# EAGLE design VoltageSourcePCBLT6000 (EAGLE 9.4.2)
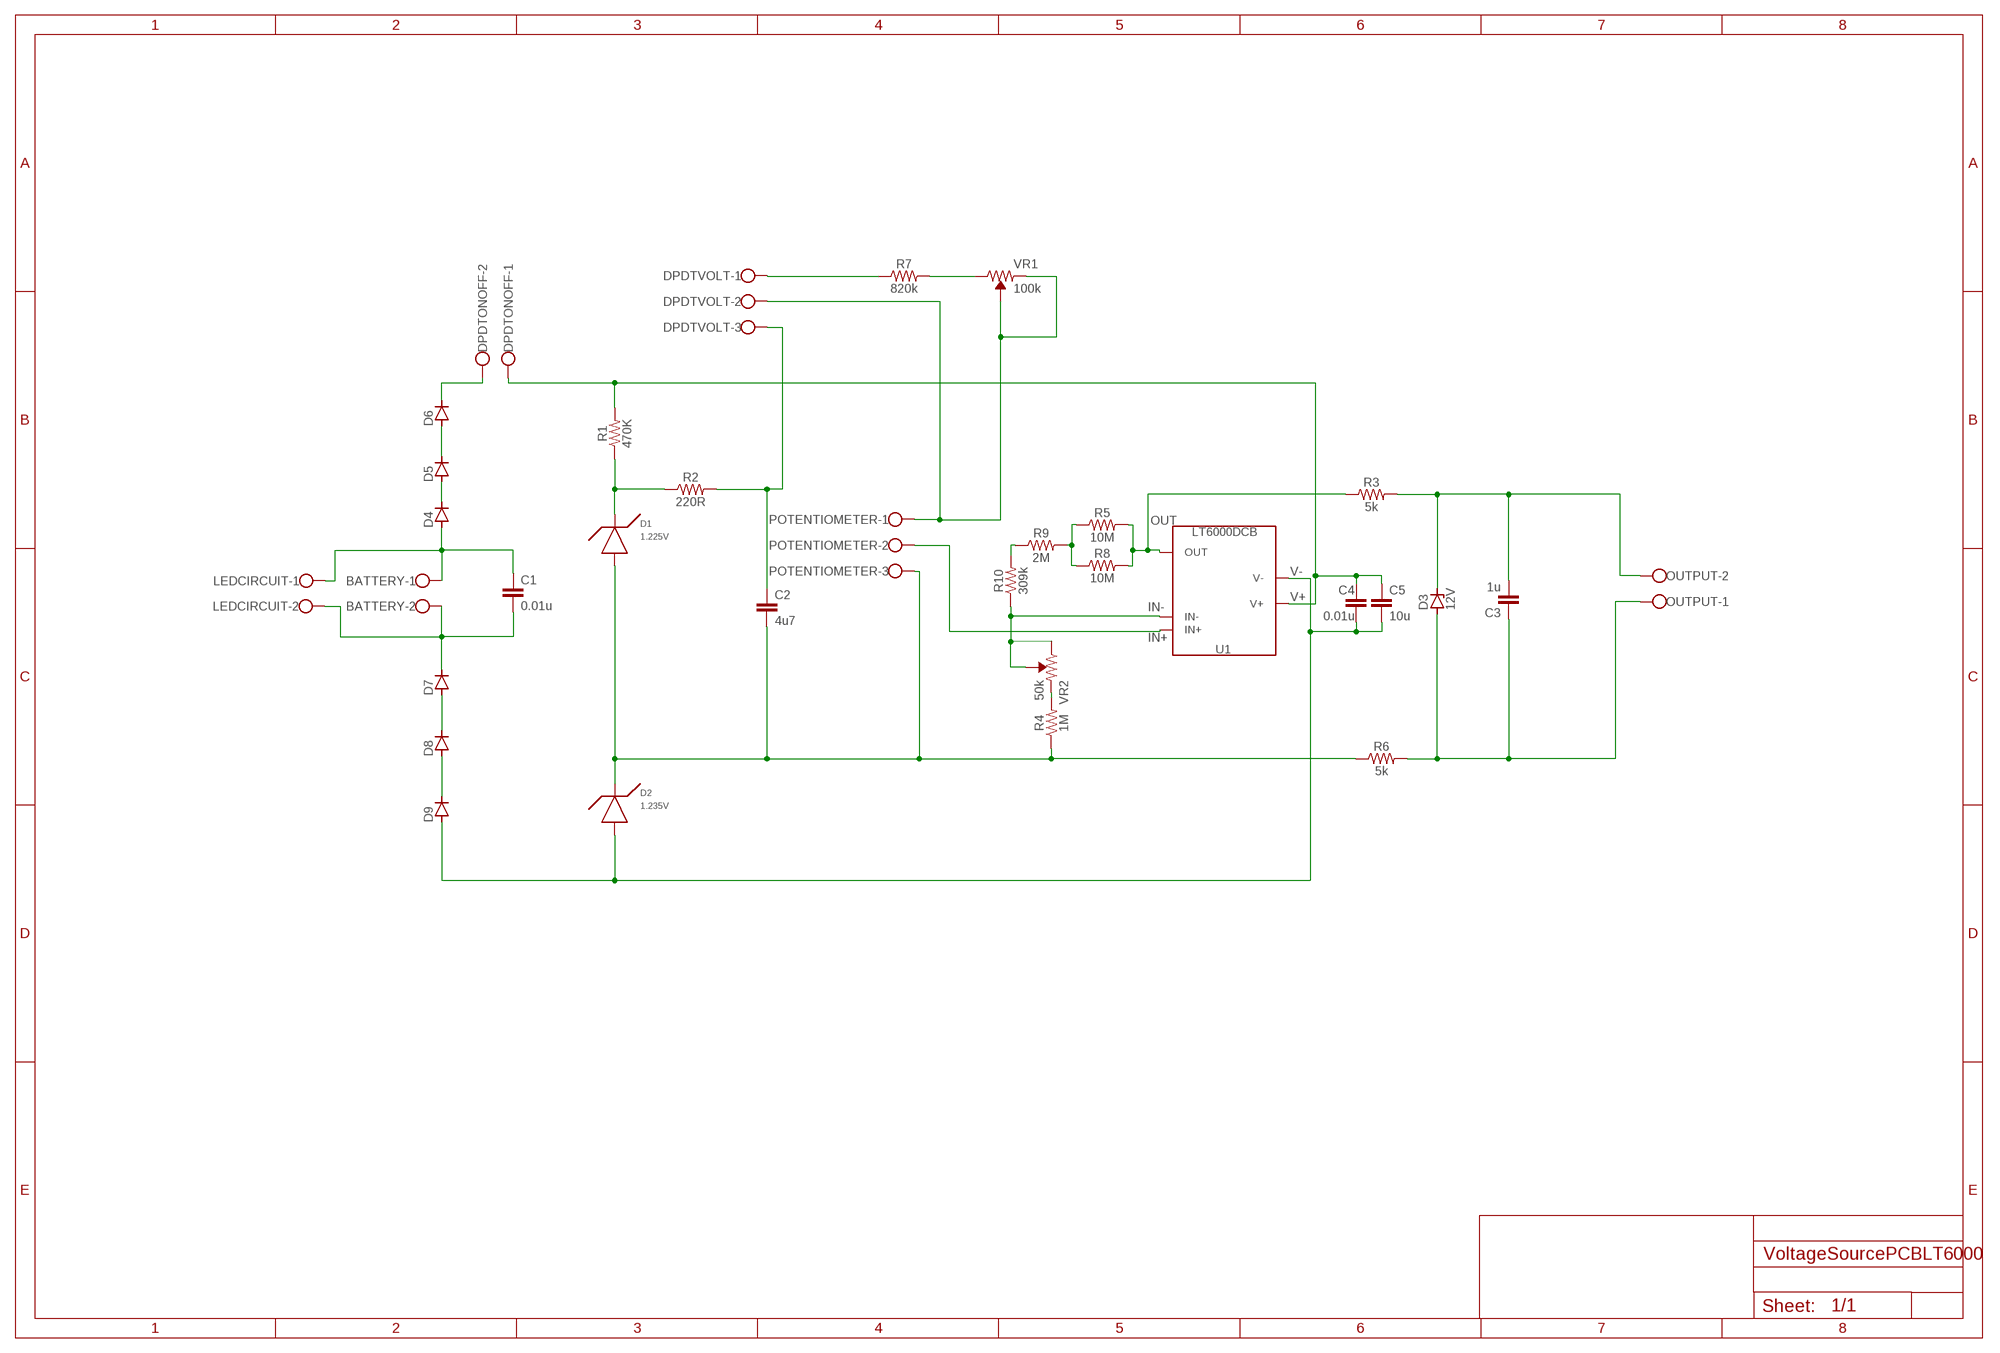
[diagram p0: schematic, sheet 1]

## Parts
BATTERY  W237-102  [W237-102]
C1  0.01u  C5/2.5  [C5B2.5]
C2  4u7  C22/11  [C22.5B11]
C3  1u  C-EU150-072X183  [C150-072X183]
C4  0.01u  C5/2.5  [C5B2.5]
C5  10u  C5/2.5  [C5B2.5]
D1  1.225V  LT1004CZ1.225V  [LT1004CZ]
D2  1.235V  LT1004CZ1.235V  [LT1004CZ]
D3  12V  ZENER-DIODEC1702-15  [C1702-15]
D4  D-SOD123  [SOD123]
D5  D-SOD123  [SOD123]
D6  D-SOD123  [SOD123]
D7  D-SOD123  [SOD123]
D8  D-SOD123  [SOD123]
D9  D-SOD123  [SOD123]
DPDTONOFF  W237-102  [W237-102]
DPDTVOLT  W237-103  [W237-103]
LEDCIRCUIT  W237-102  [W237-102]
OUTPUT  W237-102  [W237-102]
POTENTIOMETER  W237-103  [W237-103]
R1  470K  RESISTOR0805  [0805]
R2  220R  RESISTOR0805  [0805]
R3  5k  RESISTOR0805  [0805]
R4  1M  RESISTOR0805  [0805]
R5  10M  RESISTOR0805  [0805]
R6  5k  RESISTOR0805  [0805]
R7  820k  RESISTOR0805  [0805]
R8  10M  RESISTOR0805  [0805]
R9  2M  RESISTOR0805  [0805]
R10  309k  RESISTOR0805  [0805]
U1  LT6000DCB  [LT6000]
VR1  100k  TRIMPOT-SMD-3MM-OPEN-1/10W-25%  [TRIMPOT-SMD-TC33X]
VR2  50k  TRIMPOT-SMD-3MM-OPEN-1/10W-25%  [TRIMPOT-SMD-TC33X]

## Nets
IN+: POTENTIOMETER.2 U1.3(IN+)
IN-: R10.1 U1.2(IN-) VR2.1(CW) VR2.2(WIPER)
N$1: BATTERY.2 C1.2 D7.1(C) LEDCIRCUIT.2
N$2: D6.1(C) DPDTONOFF.2
N$4: D4.1(C) D5.2(A)
N$5: D5.1(C) D6.2(A)
N$6: D1.CATHODE R1.1 R2.1
N$7: C2.2 D1.ANODE D2.CATHODE POTENTIOMETER.3 R4.1 R6.1
N$8: C2.1 DPDTVOLT.3 R2.2
N$9: D7.2(A) D8.1(C)
N$10: D8.2(A) D9.1(C)
N$11: DPDTVOLT.2 POTENTIOMETER.1 VR1.2(WIPER) VR1.3(CCW)
N$12: DPDTVOLT.1 R7.1
N$14: BATTERY.1 C1.1 D4.2(A) LEDCIRCUIT.1
N$15: R5.1 R8.1 R9.2
N$16: C3.2 D3.C OUTPUT.2 R3.2
N$17: C3.1 D3.A OUTPUT.1 R6.2
N$18: R4.2 VR2.3(CCW)
N$19: R7.2 VR1.1(CW)
N$20: R9.1 R10.2
OUT: R3.1 R5.2 R8.2 U1.4(OUT)
V+: C4.1 C5.1 DPDTONOFF.1 R1.2 U1.6(V+)
V-: C4.2 C5.2 D2.ANODE D9.2(A) U1.5(V-) U1.7(V-)

## Library data of the parts
BATTERY DPDTONOFF LEDCIRCUIT OUTPUT = con-wago-500:W237-102: WAGO SCREW CLAMP; MPN: 237-102; OC_FARNELL: unknown; OC_NEWARK: 70K9898
C1 C2 C4 C5 = capacitor-wima:C: CAPACITOR naming: grid - package width
C3 = rcl:C-EU: CAPACITOR, European symbol; SPICEPREFIX: C
D1 D2 = RequiredComponents:LT1004CZ: The LT1004CZ zener diode is one that is contained in a 3 pin holder. This can be used as a micropower voltage reference, as it will supply a constant voltage.
D3 = diode:ZENER-DIODE: Z-Diode
D4-D9 = semicon-smd-ipc:D-: DIODE unfilled
DPDTVOLT POTENTIOMETER = con-wago-500:W237-103: WAGO SCREW CLAMP; MPN: 237-103; OC_FARNELL: unknown; OC_NEWARK: 18M7116
R1-R10 = SparkFun-Resistors:RESISTOR: Generic Resistor Package
U1 = RequiredComponents:LT6000: The LT6000 is a low noise, low current (16uA) op-amp, which takes a supply voltage of 16V.
VR1 VR2 = SparkFun-Resistors:TRIMPOT: Trimming Potentiometer (Trimpot) Three-terminal potentiometers, with an adjustable wiper and two adjustable resistors. A pot can be used to create a configurable voltage divider, or as a variable resistor. "Trimpots" are a subset of potentiometers, usually intended for "set-and-forget" applications. They're often more delicate than standard potentiometers - rated for fewer turns. Variants PTH-KNOB - PTH Trimpot w/ finger-adjustable knob Trimpot 10K with Knob <https://www.sparkfun.com/products/9806> (COM-09806) Datasheet <http://www.sparkfun.com/datasheets/Components/General/TSR-3386.pdf> SMD-3MM-CLOSED-FRAME - SMD 3mm Square Closed-Frame Trimpot Used on e.g. EasyDriver - Stepper Motor Driver <https://www.sparkfun.com/products/12779> Datasheet <http://www.bitechnologies.com/pdfs/22.pdf> (22AR10KTR) SMD-5MM - SMD 5mm Square Closed-Frame Trimpot Used on e.g. IOIO-OTG - V2.2 <https://www.sparkfun.com/products/13613> Datasheet <http://www.vishay.com/docs/51008/ts53.pdf> (TS53YL502MR10) SMD-3MM-1/10W-25% - 3mm Square Open-Frame Trimpot Used on e.g. SparkFun Shapeoko <https://www.sparkfun.com/products/13899> Datasheet <http://www.bourns.com/docs/Product-Datasheets/TC33.pdf> (TC33X-2-103E); PROD_ID: RES-12428, RES-08048; VALUE: 10k

## Board
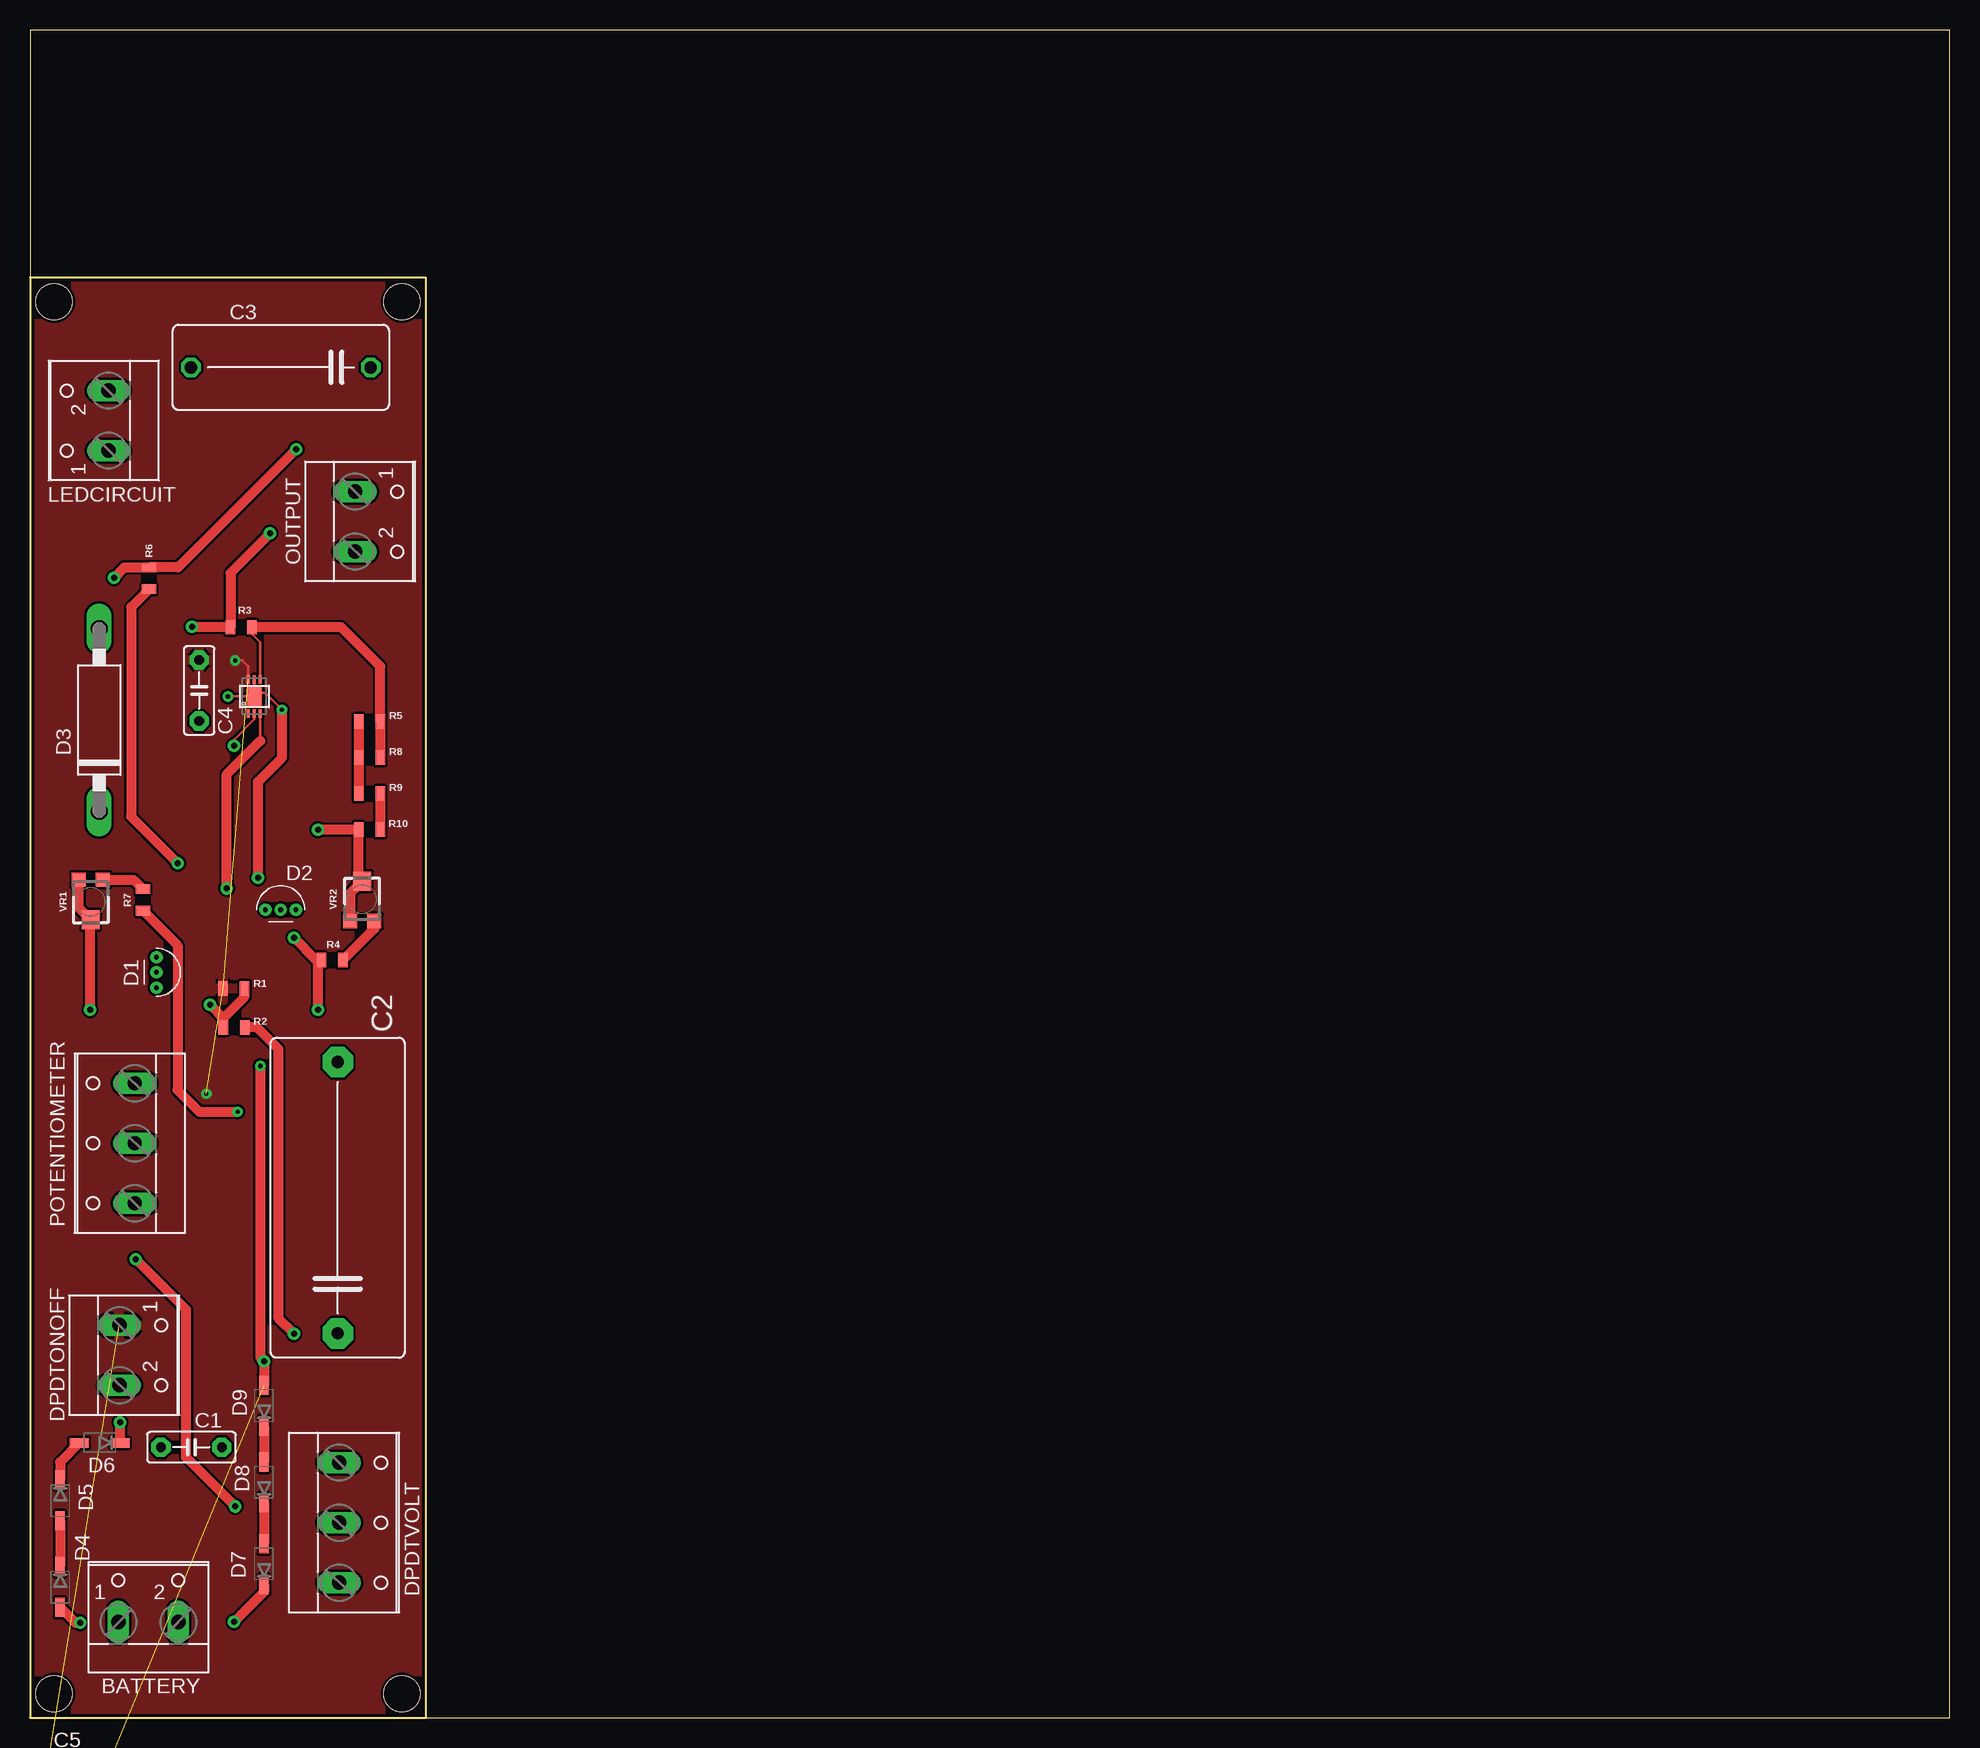
[diagram p1: board, top side]
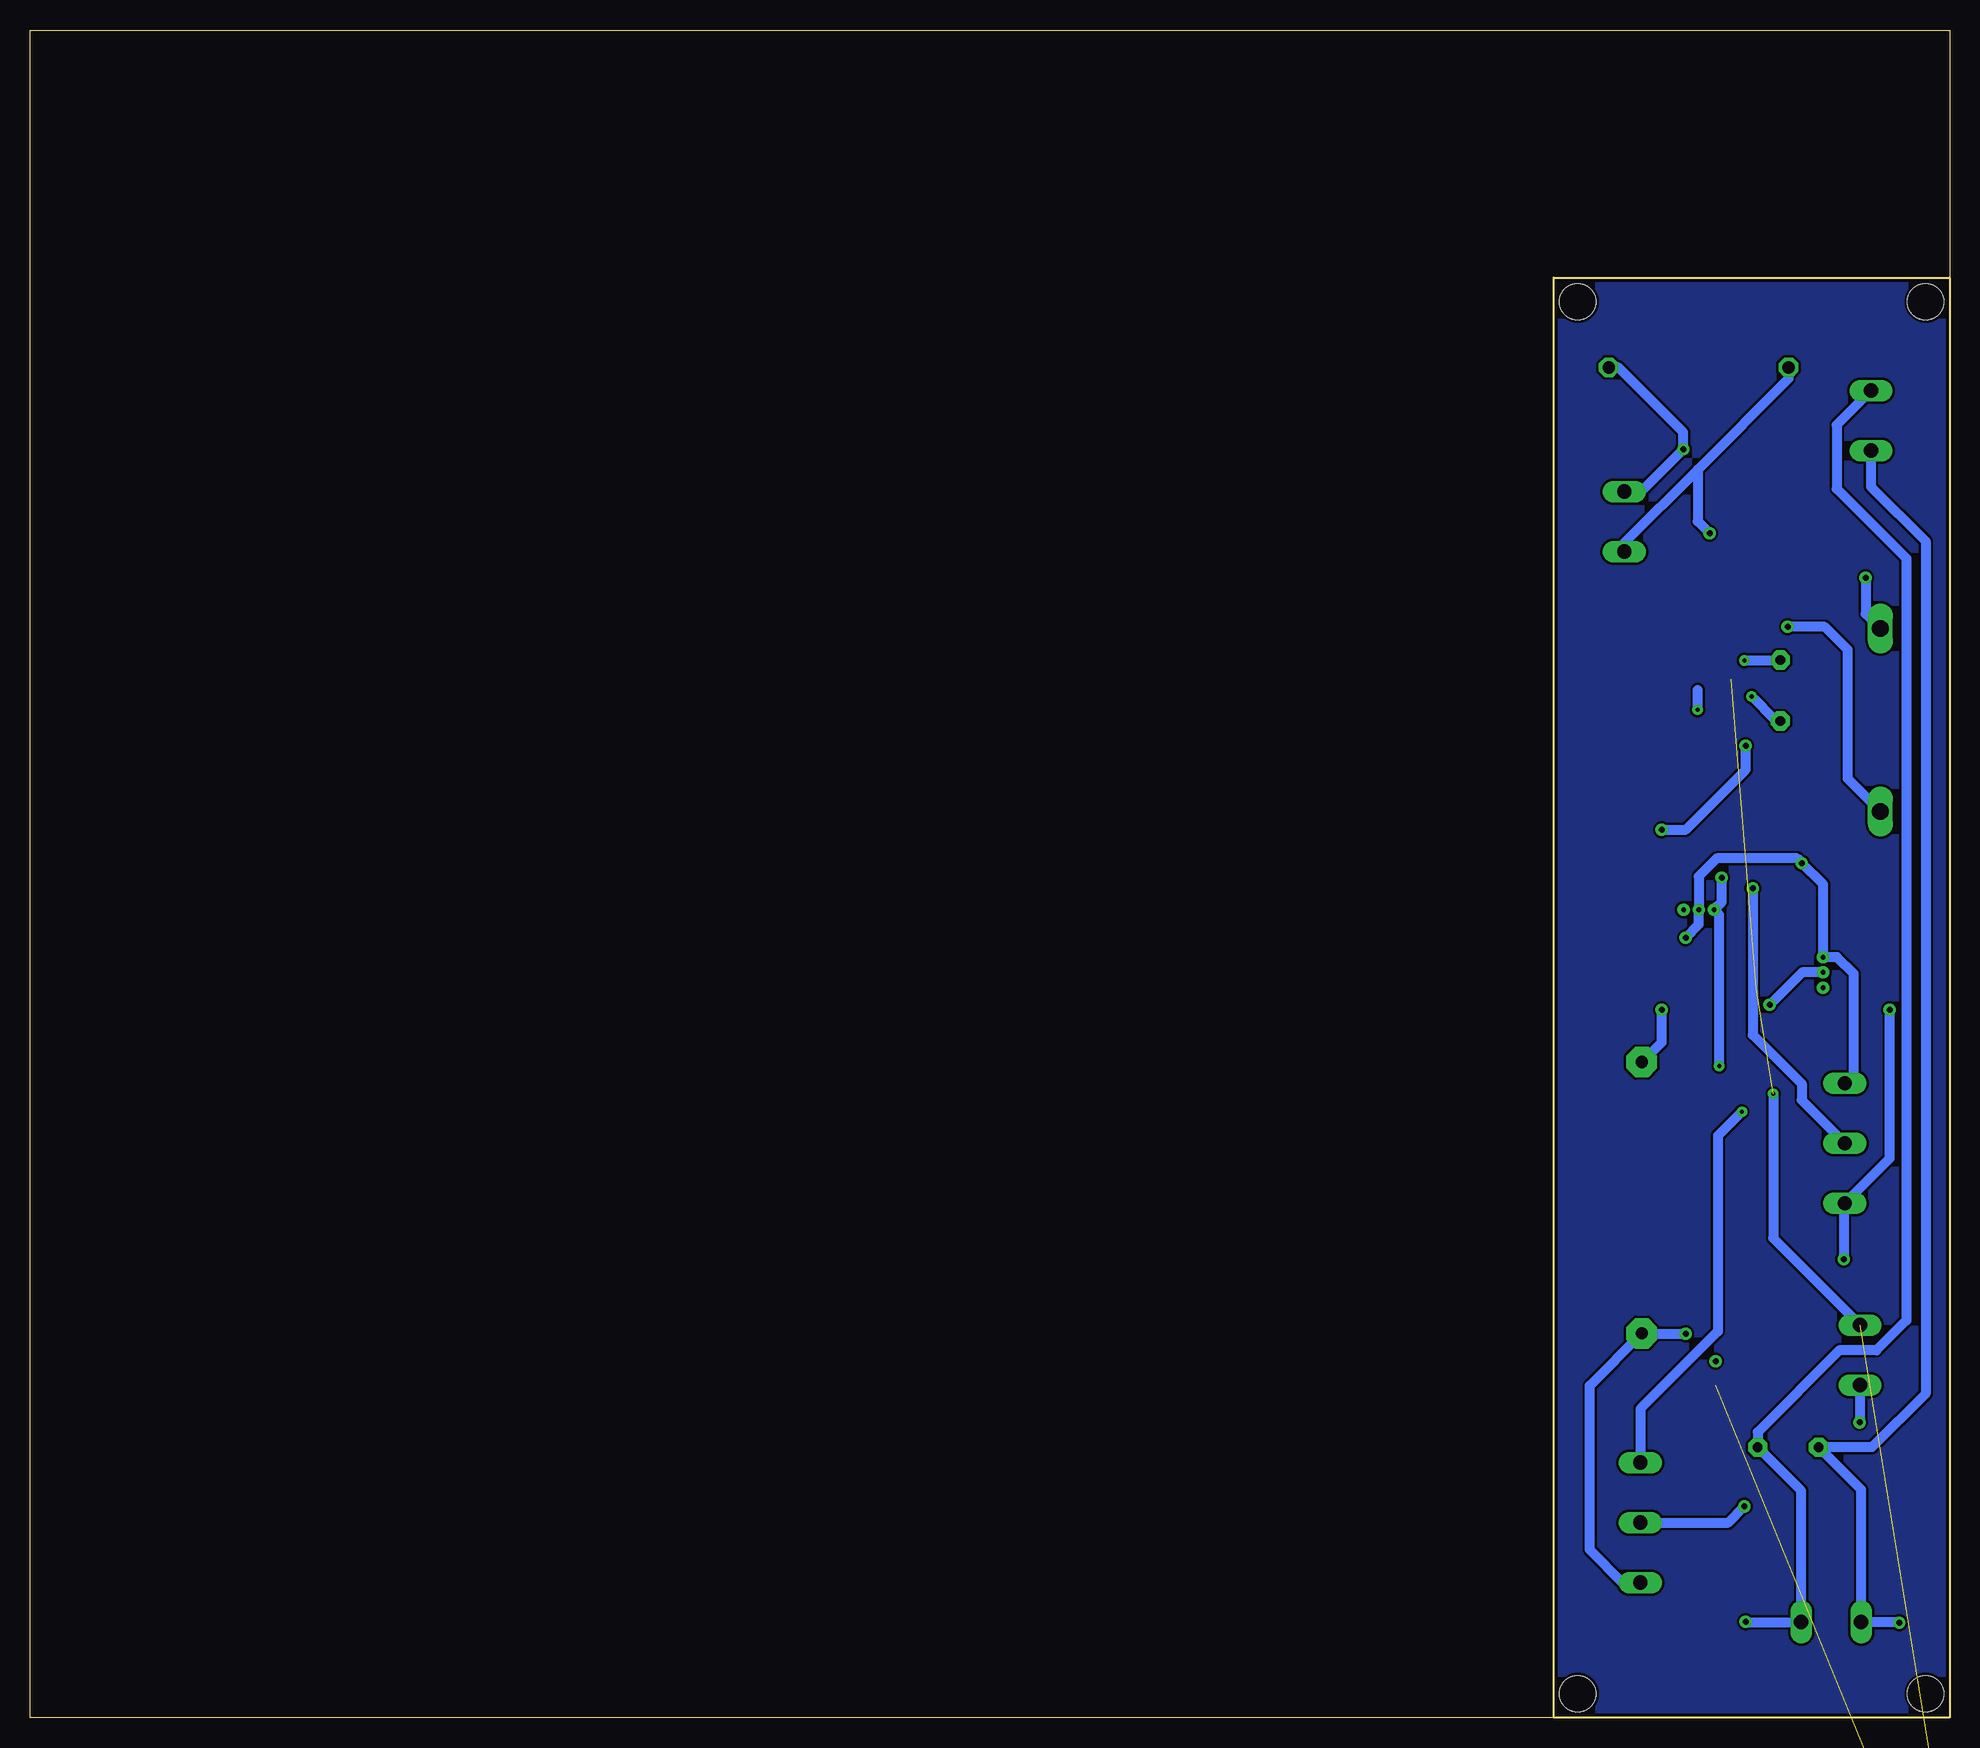
[diagram p2: board, bottom side, seen from below]

Size 160 x 140.64 mm. Coordinates in mm from the lower left corner, seen from the top.
Outline: 33,0 160,0 160,140.64 0,140.64 0,120
Outline: 33,0 33,120 0,120
Outline: 0,120 0,0 33,0
Copper layers (1*16): Top 0.035mm / dielectric 1.5mm / Bottom 0.035mm
Design rules "PCBTrain": minimum track width 8mil, minimum drill 0.2mm, track to track 8mil, track to pad 8mil, pad to pad 8mil, via to via 8mil, smd to smd 8mil, copper to edge 0.25mm, drill to drill 8mil, minimum pad ring 12mil, minimum via ring 10mil, stop-mask expansion 4mil, vias tented up to drill 20mil, thermal gap 10mil
Holes 3 mm at 2,2 31,2 2,118 31,118

### Footprints (pad centres in the part's own frame; a part is rotated, then mirrored left to right if it is on the bottom)
W237-102 = drill 1.194 long: 1 -2.5,-1.27; 2 2.5,-1.27
C5B2.5 = drill 0.813 pad 1.6 octagon: 1 -2.54,0; 2 2.54,0
C22.5B11 = drill 1.016 pad 2.54 octagon: 1 -11.303,0; 2 11.303,0
C150-072X183 = drill 1.016 octagon: 1 -7.493,0; 2 7.493,0
LT1004CZ = drill 0.406: ANODE -1.27,0; CATHODE 0,0; NC 1.27,0
C1702-15 = drill 1.397 long: A 7.62,0; C -7.62,0
SOD123 = smd 1.6 x 0.8: 1 -1.7,0; 2 1.7,0
W237-103 = drill 1.194 long: 1 -5,-1.29; 2 0,-1.29; 3 5,-1.29
0805 = smd 0.8 x 1.2: 1 -0.9,0; 2 0.9,0
LT6000 = smd 0.25 x 0.7: 1 -0.5,-1.425; 2 0,-1.425; 3 0.5,-1.425; 4 0.5,1.425; 5 0,1.425; 6 -0.5,1.425 | smd 1.25 x 1.55: 7 0,0
TRIMPOT-SMD-TC33X = smd 1.2 x 1.2: 1 -1,-1.825; 3 1,-1.825 | smd 1.5 x 1.6: 2 0,1.5

### Placement (x,y rotation side)
BATTERY  9.87,9.23 0 top
C1  13.45,22.54 0 top
C2  25.65,43.33 90 top
C3  20.91,112.52 180 top
C4  14.1,85.6 270 top
C5  4,-4 0 top  (outside the outline)
D1  10.54,62.11 270 top
D2  20.9,67.34 0 top
D3  5.77,83.14 90 top
D4  2.5,10.9 270 top
D5  2.5,18.1 270 top
D6  5.8,22.9 180 top
D7  19.5,12.8 90 top
D8  19.5,19.6 90 top
D9  19.5,26 90 top
DPDTONOFF  8.72,30.21 270 top
DPDTVOLT  27.06,16.26 270 top
LEDCIRCUIT  5.28,108.09 90 top
OUTPUT  28.38,99.68 270 top
POTENTIOMETER  7.44,47.87 90 top
R1  16.99,60.77 180 top
R2  17,57.53 0 top
R3  17.61,90.87 180 top
R4  25.18,63.13 0 top
R5  28.3,83 0 top
R6  9.92,94.95 90 top
R7  9.42,68.14 90 top
R8  28.3,80 0 top
R9  28.3,77 180 top
R10  28.3,74 0 top
U1  18.7,85.1 0 top
VR1  5.06,68 180 top
VR2  27.69,68.2 0 top

### Tracks (layer width: path | path; a pad name or v marks a point on that pad's centre or on a via)
GND
  pour Bottom: 0,120 33,120 33,0 0,0
IN+  (via drill 0.5)
  Top 0.203: 19.2,81.4 U1.3
  Top 0.813: 19.2,81.4 16.4,78.6 v16.4,69.1
  Bottom 0.813: v16.4,69.1 16.4,56.9 12.33,52.83 12.33,51.47 POTENTIOMETER.2
IN-  (via drill 0.5)
  Top 0.203: v17,81 17,81.5 18.7,83.2 U1.2
  Top 0.813: VR2.1 26.69,68.7 VR2.2 27.4,69.99 R10.1 v24,74
  Bottom 0.813: v24,74 22,74 17,79 v17,81
N$1  (via drill 0.5)
  Top 0.813: D7.1 19.5,10.5 v17,8
  Bottom 0.813: v17,8 16.96,7.96 BATTERY.2 12.37,18.9 C1.2 | C1.2 | LEDCIRCUIT.2 9.4,107.74 9.4,102.4 3.6,96.6 3.6,33.1 6.1,30.6 9.2,30.6 16,23.8 C1.2
N$2  (via drill 0.5)
  Top 0.813: D6.1 v7.5,24.6
  Bottom 0.813: v7.5,24.6 7.45,24.65 DPDTONOFF.2
N$4
  Top 0.813: D5.2 D4.1
N$5
  Top 0.813: D6.2 2.5,21.3 D5.1
N$6  (via drill 0.5)
  Top 0.813: R2.1 16.1,58.3 | R1.1 17.89,60.09 16.1,58.3 | v15,59.4 16.1,58.3
  Bottom 0.813: D1.CATHODE 12.29,62.11 v15,59.4
N$7  (via drill 0.5)
  Top 0.813: v22,65 23.87,63.13 R4.1 24,62.85 v24,59 | R6.1 8.42,92.55 8.42,75.08 v12.3,71.2
  Bottom 0.813: v22,65 20.9,66.1 D2.CATHODE 20.9,70.1 19.4,71.6 12.7,71.6 v12.3,71.2 10.54,69.44 D1.ANODE 9.38,63.38 8,62 8,53.6 POTENTIOMETER.3 | C2.2 24,56.28 v24,59
N$8  (via drill 0.5)
  Top 0.813: v22,32 20.7,33.3 20.7,55.73 18.9,57.53 R2.2
  Bottom 0.813: DPDTVOLT.3 27.26,11.26 30,14 30,27.68 C2.1 25.62,32 v22,32
N$9
  Top 0.813: D8.1 D7.2
N$10
  Top 0.813: D9.1 D8.2
N$11  (via drill 0.5)
  Top 0.813: v17.1,17.6 13,21.7 13,34 v8.8,38.2 | v5,59 5,66.44 VR1.2 4.06,67.5 VR1.3
  Bottom 0.813: DPDTVOLT.2 18.44,16.26 v17.1,17.6 | v8.8,38.2 8.8,42.8 POTENTIOMETER.1 5,46.6 v5,59
N$12  (via drill 0.35)
  Top 0.813: R7.1 12.3,64.36 12.3,52.3 14.1,50.5 v17.3,50.5
  Bottom 0.813: DPDTVOLT.1 25.77,25.73 19.3,32.2 19.3,48.5 v17.3,50.5
N$14  (via drill 0.5)
  Top 0.813: D4.2 3.8,7.9 v4.2,7.9
  Bottom 0.813: LEDCIRCUIT.1 6.55,102.59 2,98.04 2,27 6.46,22.54 C1.1 7.37,19 BATTERY.1 4.26,7.96 v4.2,7.9
N$15
  Top 0.813: R9.2 R8.1 R5.1
N$16  (via drill 0.5)
  Top 0.813: v20,98.7 16.71,95.41 R3.2 16.68,90.9 v13.5,90.9
  Bottom 0.813: D3.C 8.5,78.25 8.5,89 10.4,90.9 v13.5,90.9 | 21,104 13.42,111.58 C3.2 | 21,104 21,99.7 v20,98.7 | OUTPUT.2 27.11,97.89 21,104
N$17  (via drill 0.5)
  Top 0.813: v7,95 7.85,95.85 R6.2 12.35,95.85 v22.2,105.7
  Bottom 0.813: v7,95 7,91.99 D3.A | OUTPUT.1 25.72,102.18 v22.2,105.7 22.2,107.1 27.62,112.52 C3.1
N$18
  Top 0.813: VR2.3 28.69,65.74 R4.2
N$19
  Top 0.813: VR1.1 8.63,69.83 R7.2
N$20
  Top 0.813: R9.1 R10.2
OUT
  Top 0.203: R3.1 18.51,90.29 19.2,89.6 U1.4
  Top 0.813: R3.1 25.93,90.87 29.2,87.6 R5.2 R8.2
V+  (via drill 0.35)  (3 unrouted)
  Top 0.203: v17.1,88.1 17.7,88.1 18.2,87.6 U1.6
  Bottom 0.813: v14.7,52 14.7,39.96 DPDTONOFF.1 | v17.1,88.1 14.14,88.1 C4.1
  pour Top: 0,120 33,120 33,0 0,0
V-  (via drill 0.35, 0.5)  (1 unrouted)
  Top 0.203: 18.41,85.39 18.6,85.2 | 18.6,85.2 U1.7 v16.5,85.1 | U1.5 18.7,85.4 | 18.7,85.4 18.7,85.3 18.6,85.2 | 18.7,85.4 19.6,85.4 v21,84
  Top 0.813: v21,84 21,80 19,78 v19,70 | D9.2 v19.5,29.7 19.2,30 v19.2,54.3
  Bottom 0.813: v19.2,54.3 19.2,66.91 D2.ANODE 19,67.97 v19,70 | v21,84 21,85.64 | C4.2 14.46,83.06 v16.5,85.1